# Altium schematic sheet Power_Selection.SchDoc
size A4
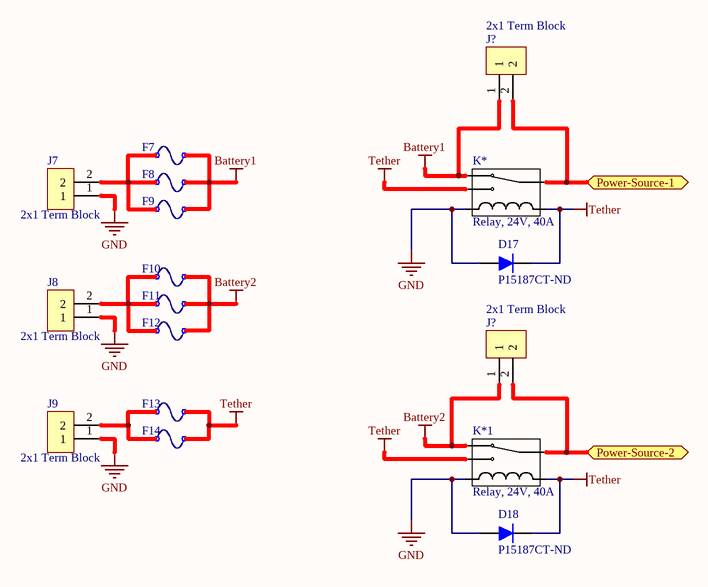
[diagram p0: Power_Selection.SchDoc]

## Parts
(Parts that share a designator on the sheet are numbered #1, #2 ... from top to bottom, then left to right.)
D17  Supplier Part Number 1: P15187CT-ND  [SODFL535X110-2N]  (hidden comment: DA2S10400L, SOD323F / SC-90)  (no BOM)
D18  Supplier Part Number 1: P15187CT-ND  [SODFL535X110-2N]  (hidden comment: DA2S10400L, SOD323F / SC-90)  (no BOM)
F7  MINI  [MINI BLADE FUSEHOLDER]  (value not drawn)
F8  MINI  [MINI BLADE FUSEHOLDER]  (value not drawn)
F9  MINI  [MINI BLADE FUSEHOLDER]  (value not drawn)
F10  MINI  [MINI BLADE FUSEHOLDER]  (value not drawn)
F11  MINI  [MINI BLADE FUSEHOLDER]  (value not drawn)
F12  MINI  [MINI BLADE FUSEHOLDER]  (value not drawn)
F13  MINI  [MINI BLADE FUSEHOLDER]  (value not drawn)
F14  MINI  [MINI BLADE FUSEHOLDER]  (value not drawn)
J7  2x1 Term Block  [2x1 Terminal Blocks EM2929]
J8  2x1 Term Block  [2x1 Terminal Blocks EM2929]
J9  2x1 Term Block  [2x1 Terminal Blocks EM2929]
J?#1  2x1 Term Block  [2x1 Terminal Blocks EM2929]
J?#2  2x1 Term Block  [2x1 Terminal Blocks EM2929]
K*  Relay, 24V, 40A  [1432871-1 Relay Footprint]
K*1  Relay, 24V, 40A  [1432871-1 Relay Footprint]

## Ports
Power-Source-1, Power-Source-2

## Nets
Battery1: F7.2 F8.2 F9.2 J?#1.1 K*.87a
Battery2: F10.2 F11.2 F12.2 J?#2.1 K*1.87a
GND: D17.1(Anode) D18.1(Anode) J7.1 J8.1 J9.1 K*.86 K*1.86
Tether: D17.2(Cathode) D18.2(Cathode) F13.2 F14.2 K*.85 K*.87 K*1.85 K*1.87
Power-Source-1: J?#1.2 K*.30 ; port Power-Source-1
Power-Source-2: J?#2.2 K*1.30 ; port Power-Source-2
NetF7_1: F7.1 F8.1 F9.1 J7.2
NetF10_1: F10.1 F11.1 F12.1 J8.2
NetF13_1: F13.1 F14.1 J9.2

## Library data of the parts
D17 D18 = DA2S10400L, SOD323F / SC-90: Forward Voltage Drop: 1.1V; Created By: Andy Bates; Publisher: AUVic; Date Created: 2016-09-08; Supplier 1: Digi-Key
F7-F14 = MINI, ATC, ATO, etc. Blade Fuse: Blade Fuse Holder, 30A; Created By: Lyden Smith; Date Created: 2018-01-11; Supplier 1: Digi-Key; Supplier Part Number 1: 36-3557-2-ND; Type: MINI
J7-J9 J?#1 J?#2 = 2x1 Terminal Block, 65A, 6-20AWG: Made by: Lyden Smith; Supplier 1: Digi-Key; Supplier Part Number 1: 283-4339-ND; Date Made: 2017-11-13
K* K*1 = Relay, 1 Form C, SPDT, 24V, 40A: Supplier 1: Digi-Key; Supplier Part Number 1: PB1042-ND